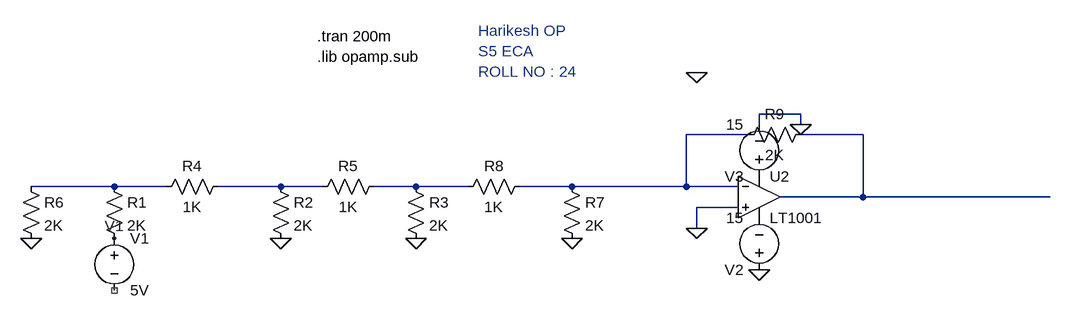
[diagram p0: schematic R-22R.asc]
R-22R.asc, the LTspice schematic file:
Version 4
SHEET 1 880 680
WIRE 256 32 192 32
WIRE 192 48 192 32
WIRE 256 48 256 32
WIRE 176 64 80 64
WIRE 352 64 256 64
WIRE -800 144 -928 144
WIRE -720 144 -800 144
WIRE -544 144 -640 144
WIRE -480 144 -544 144
WIRE -336 144 -400 144
WIRE -256 144 -336 144
WIRE -96 144 -176 144
WIRE 80 144 80 64
WIRE 80 144 -96 144
WIRE 160 144 80 144
WIRE 352 160 352 64
WIRE 352 160 224 160
WIRE 640 160 352 160
WIRE 160 176 96 176
WIRE 96 208 96 176
FLAG -928 224 0
FLAG 96 208 0
FLAG 96 -32 0
FLAG -96 224 0
FLAG -336 224 0
FLAG -544 224 0
FLAG -800 224 V1
FLAG 256 48 0
FLAG 192 272 0
SYMBOL res -816 128 R0
SYMATTR InstName R1
SYMATTR Value 2K
SYMBOL res -560 128 R0
SYMATTR InstName R2
SYMATTR Value 2K
SYMBOL res -352 128 R0
SYMATTR InstName R3
SYMATTR Value 2K
SYMBOL res -624 128 R90
WINDOW 0 0 56 VBottom 2
WINDOW 3 32 56 VTop 2
SYMATTR InstName R4
SYMATTR Value 1K
SYMBOL res -384 128 R90
WINDOW 0 0 56 VBottom 2
WINDOW 3 32 56 VTop 2
SYMATTR InstName R5
SYMATTR Value 1K
SYMBOL res -944 128 R0
SYMATTR InstName R6
SYMATTR Value 2K
SYMBOL res -112 128 R0
SYMATTR InstName R7
SYMATTR Value 2K
SYMBOL res -160 128 R90
WINDOW 0 0 56 VBottom 2
WINDOW 3 32 56 VTop 2
SYMATTR InstName R8
SYMATTR Value 1K
SYMBOL res 272 48 R90
WINDOW 0 0 56 VBottom 2
WINDOW 3 32 56 VTop 2
SYMATTR InstName R9
SYMATTR Value 2K
SYMBOL voltage -800 208 R0
WINDOW 123 0 0 Left 0
WINDOW 39 0 0 Left 0
SYMATTR InstName V1
SYMATTR Value 5V
SYMBOL voltage 192 288 R180
WINDOW 123 0 0 Left 0
WINDOW 39 0 0 Left 0
SYMATTR InstName V2
SYMATTR Value 15
SYMBOL voltage 192 144 R180
WINDOW 123 0 0 Left 0
WINDOW 39 0 0 Left 0
SYMATTR InstName V3
SYMATTR Value 15
SYMBOL OpAmps\\LT1001 192 96 R0
SYMATTR InstName U2
TEXT -488 -88 Left 2 !.tran 200m
TEXT -488 -56 Left 2 !.lib opamp.sub
TEXT -240 -96 Left 2 ;Harikesh OP\nS5 ECA \nROLL NO : 24

The netlist it stands for:
* R-22R.asc
R1 N003 V1 2K
R2 N004 0 2K
R3 N005 0 2K
R4 N004 N003 1K
R5 N005 N004 1K
R6 N003 0 2K
R7 N001 0 2K
R8 N001 N005 1K
R9 N002 N001 2K
V1 V1 NC_01 5V
V2 0 P001 15
V3 P002 0 15
XU2 0 N001 P002 P001 N002 LT1001  ; pins In+ In- V+ V- OUT
.tran 200m
.lib opamp.sub
* Harikesh OP
* S5 ECA
* ROLL NO : 24
.lib LTC.lib
.backanno
.end